# EAGLE schematic eeprom_programmer (EAGLE 9.6.2)
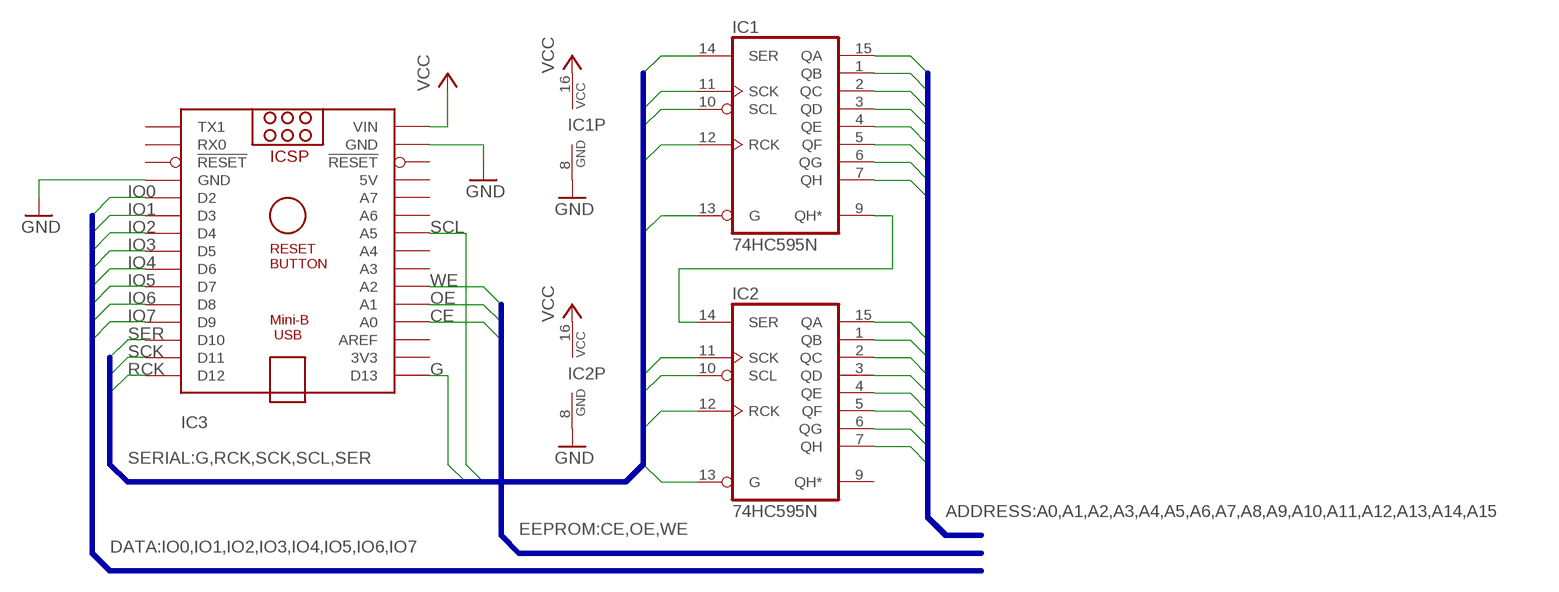
[diagram p0: schematic, sheet 1]

## Parts
IC1  74HC595N  [DIL16]
IC2  74HC595N  [DIL16]
IC3  ARDUINO-NANO  [ARDUINO_NANO]

## Nets
A0: IC1.15(QA)
A1: IC1.1(QB)
A2: IC1.2(QC)
A3: IC1.3(QD)
A4: IC1.4(QE)
A5: IC1.5(QF)
A6: IC1.6(QG)
A7: IC1.7(QH)
A8: IC2.15(QA)
A9: IC2.1(QB)
A10: IC2.2(QC)
A11: IC2.3(QD)
A12: IC2.4(QE)
A13: IC2.5(QF)
A14: IC2.6(QG)
A15: IC2.7(QH)
CE: IC3.4(A0)
G: IC1.13(G) IC2.13(G) IC3.1(D13)
GND: IC1.8(GND) IC2.8(GND) IC3.14(GND) IC3.19(GND)
IO0: IC3.20(D2)
IO1: IC3.21(D3)
IO2: IC3.22(D4)
IO3: IC3.23(D5)
IO4: IC3.24(D6)
IO5: IC3.25(D7)
IO6: IC3.26(D8)
IO7: IC3.27(D9)
N$1: IC1.9(QH*) IC2.14(SER)
OE: IC3.5(A1)
RCK: IC1.12(RCK) IC2.12(RCK) IC3.30(D12)
SCK: IC1.11(SCK) IC2.11(SCK) IC3.29(D11)
SCL: IC1.10(SCL) IC2.10(SCL) IC3.9(A5)
SER: IC1.14(SER) IC3.28(D10)
VCC: IC1.16(VCC) IC2.16(VCC) IC3.15(VIN)
WE: IC3.6(A2)
Unconnected: IC2.9(QH*) IC3.2(3V3) IC3.3(AREF) IC3.7(A3) IC3.8(A4) IC3.10(A6) IC3.11(A7) IC3.13(!RESET) IC3.16(TX1) IC3.17(RX0) IC3.18(!RESET)

## Buses
DATA:IO0,IO1,IO2,IO3,IO4,IO5,IO6,IO7
SERIAL:G,RCK,SCK,SCL,SER
EEPROM:CE,OE,WE
ADDRESS:A0,A1,A2,A3,A4,A5,A6,A7,A8,A9,A10,A11,A12,A13,A14,A15

## Power pins joined to a net without a drawn wire
5V: IC3.12(5V)

## Library data of the parts
IC1 IC2 = 74xx-eu:74*595: 8-bit SHIFT REGISTER, output latch
IC3 = CiniTechLibrary:ARDUINO-NANO: Arduino Nano V3.0 Overview: The Arduino Nano is a small, complete, and breadboard-friendly board based on the ATmega328 (Arduino Nano 3.x) or ATmega168 (Arduino Nano 2.x). It has more or less the same functionality of the Arduino Duemilanove, but in a different package. It lacks only a DC power jack, and works with a Mini-B USB cable instead of a standard one. The Nano was designed and is being produced by Gravitech. Specifications: Microcontroller Atmel ATmega168 or ATmega328 Operating Voltage (logic level) 5 V Input Voltage (recommended) 7-12 V Input Voltage (limits) 6-20 V Digital I/O Pins 14 (of which 6 provide PWM output) Analog Input Pins 8 DC Current per I/O Pin 40 mA Flash Memory 16 KB (ATmega168) or 32 KB (ATmega328) of which 2 KB used by bootloader SRAM 1 KB (ATmega168) or 2 KB (ATmega328) EEPROM 512 bytes (ATmega168) or 1 KB (ATmega328) Clock Speed 16 MHz Dimensions 0.73" x 1.70" Length 45 mm Width 18 mm Weigth 5 g Power: The Arduino Nano can be powered via the Mini-B USB connection, 6-20V unregulated external power supply (pin 30), or 5V regulated external power supply (pin 27). The power source is automatically selected to the highest voltage source. Memory: The ATmega168 has 16 KB of flash memory for storing code (of which 2 KB is used for the bootloader); the ATmega328 has 32 KB, (also with 2 KB used for the bootloader). The ATmega168 has 1 KB of SRAM and 512 bytes of EEPROM (which can be read and written with the EEPROM library); the ATmega328 has 2 KB of SRAM and 1 KB of EEPROM. Input and Output: Each of the 14 digital pins on the Nano can be used as an input or output, using pinMode(), digitalWrite(), and digitalRead() functions. They operate at 5 volts. Each pin can provide or receive a maximum of 40 mA and has an internal pull-up resistor (disconnected by default) of 20-50 kOhms. In addition, some pins have specialized functions. Visit Arduino - ArduinoBoardNano <https://www.arduino.cc/en/Main/ArduinoBoardNano>